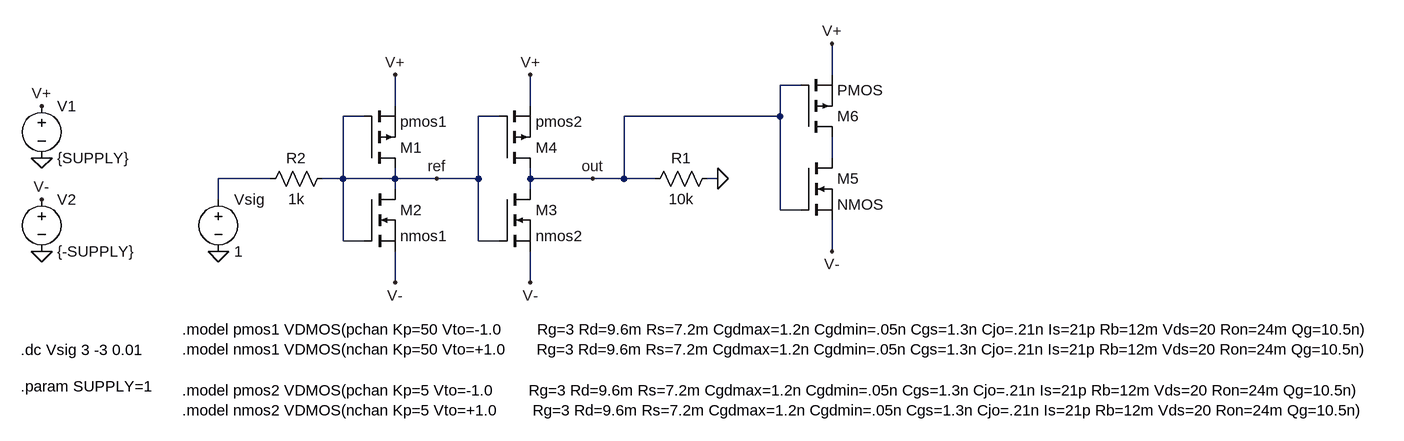
[diagram p0: schematic Week13_Current_Mirror_with_Sigmoid.asc]
Week13_Current_Mirror_with_Sigmoid.asc, the LTspice schematic file:
Version 4
SHEET 1 2176 680
WIRE 976 -80 976 -128
WIRE 928 -64 896 -64
WIRE 304 -32 304 -80
WIRE 512 -32 512 -80
WIRE 256 -16 224 -16
WIRE 464 -16 432 -16
WIRE 896 -16 896 -64
WIRE 896 -16 656 -16
WIRE 976 48 976 16
WIRE 112 80 32 80
WIRE 224 80 224 -16
WIRE 224 80 192 80
WIRE 304 80 304 64
WIRE 304 80 224 80
WIRE 368 80 304 80
WIRE 432 80 432 -16
WIRE 432 80 368 80
WIRE 512 80 512 64
WIRE 608 80 512 80
WIRE 656 80 656 -16
WIRE 656 80 608 80
WIRE 704 80 656 80
WIRE 800 80 784 80
WIRE 304 96 304 80
WIRE 512 96 512 80
WIRE 32 112 32 80
WIRE 896 128 896 -16
WIRE 928 128 896 128
WIRE 224 176 224 80
WIRE 256 176 224 176
WIRE 432 176 432 80
WIRE 464 176 432 176
WIRE 976 192 976 144
WIRE 304 240 304 192
WIRE 512 240 512 192
FLAG -240 48 0
FLAG -240 -32 V+
FLAG -240 192 0
FLAG -240 112 V-
FLAG 304 -80 V+
FLAG 32 192 0
FLAG 304 240 V-
FLAG 512 -80 V+
FLAG 512 240 V-
FLAG 608 80 out
FLAG 368 80 ref
FLAG 800 80 0
FLAG 976 -128 V+
FLAG 976 192 V-
SYMBOL pmos 256 64 M180
SYMATTR InstName M1
SYMATTR Value pmos1
SYMBOL voltage -240 -48 R0
WINDOW 123 0 0 Left 0
WINDOW 39 0 0 Left 0
SYMATTR InstName V1
SYMATTR Value {SUPPLY}
SYMBOL voltage -240 96 R0
WINDOW 123 0 0 Left 0
WINDOW 39 0 0 Left 0
SYMATTR InstName V2
SYMATTR Value {-SUPPLY}
SYMBOL voltage 32 96 R0
WINDOW 123 0 0 Left 0
WINDOW 39 0 0 Left 0
SYMATTR InstName Vsig
SYMATTR Value 1
SYMBOL nmos 256 96 R0
SYMATTR InstName M2
SYMATTR Value nmos1
SYMBOL res 96 96 R270
WINDOW 0 32 56 VTop 2
WINDOW 3 0 56 VBottom 2
SYMATTR InstName R2
SYMATTR Value 1k
SYMBOL nmos 464 96 R0
SYMATTR InstName M3
SYMATTR Value nmos2
SYMBOL pmos 464 64 M180
SYMATTR InstName M4
SYMATTR Value pmos2
SYMBOL res 688 96 R270
WINDOW 0 32 56 VTop 2
WINDOW 3 0 56 VBottom 2
SYMATTR InstName R1
SYMATTR Value 10k
SYMBOL nmos 928 48 R0
SYMATTR InstName M5
SYMBOL pmos 928 16 M180
SYMATTR InstName M6
TEXT -24 312 Left 2 !.model pmos1 VDMOS(pchan Kp=50 Vto=-1.0        Rg=3 Rd=9.6m Rs=7.2m Cgdmax=1.2n Cgdmin=.05n Cgs=1.3n Cjo=.21n Is=21p Rb=12m Vds=20 Ron=24m Qg=10.5n)\n.model nmos1 VDMOS(nchan Kp=50 Vto=+1.0       Rg=3 Rd=9.6m Rs=7.2m Cgdmax=1.2n Cgdmin=.05n Cgs=1.3n Cjo=.21n Is=21p Rb=12m Vds=20 Ron=24m Qg=10.5n)\n \n.model pmos2 VDMOS(pchan Kp=5 Vto=-1.0        Rg=3 Rd=9.6m Rs=7.2m Cgdmax=1.2n Cgdmin=.05n Cgs=1.3n Cjo=.21n Is=21p Rb=12m Vds=20 Ron=24m Qg=10.5n)\n.model nmos2 VDMOS(nchan Kp=5 Vto=+1.0        Rg=3 Rd=9.6m Rs=7.2m Cgdmax=1.2n Cgdmin=.05n Cgs=1.3n Cjo=.21n Is=21p Rb=12m Vds=20 Ron=24m Qg=10.5n)
TEXT -272 400 Left 2 !.param SUPPLY=1
TEXT -272 344 Left 2 !.dc Vsig 3 -3 0.01

The netlist it stands for:
* Week13_Current_Mirror_with_Sigmoid.asc
M1 ref ref V+ V+ pmos1
V1 V+ 0 {SUPPLY}
V2 V- 0 {-SUPPLY}
Vsig N002 0 1
M2 ref ref V- V- nmos1
R2 N002 ref 1k
M3 out ref V- V- nmos2
M4 out ref V+ V+ pmos2
R1 out 0 10k
M5 N001 out V- V- NMOS
M6 N001 out V+ V+ PMOS
.model NMOS NMOS
.model PMOS PMOS
.lib standard.mos
.model pmos1 VDMOS(pchan Kp=50 Vto=-1.0        Rg=3 Rd=9.6m Rs=7.2m Cgdmax=1.2n Cgdmin=.05n Cgs=1.3n Cjo=.21n Is=21p Rb=12m Vds=20 Ron=24m Qg=10.5n)
.model nmos1 VDMOS(nchan Kp=50 Vto=+1.0       Rg=3 Rd=9.6m Rs=7.2m Cgdmax=1.2n Cgdmin=.05n Cgs=1.3n Cjo=.21n Is=21p Rb=12m Vds=20 Ron=24m Qg=10.5n)
.model pmos2 VDMOS(pchan Kp=5 Vto=-1.0        Rg=3 Rd=9.6m Rs=7.2m Cgdmax=1.2n Cgdmin=.05n Cgs=1.3n Cjo=.21n Is=21p Rb=12m Vds=20 Ron=24m Qg=10.5n)
.model nmos2 VDMOS(nchan Kp=5 Vto=+1.0        Rg=3 Rd=9.6m Rs=7.2m Cgdmax=1.2n Cgdmin=.05n Cgs=1.3n Cjo=.21n Is=21p Rb=12m Vds=20 Ron=24m Qg=10.5n)
.param SUPPLY=1
.dc Vsig 3 -3 0.01
.backanno
.end